# EAGLE design canset pcb (EAGLE 6.4)
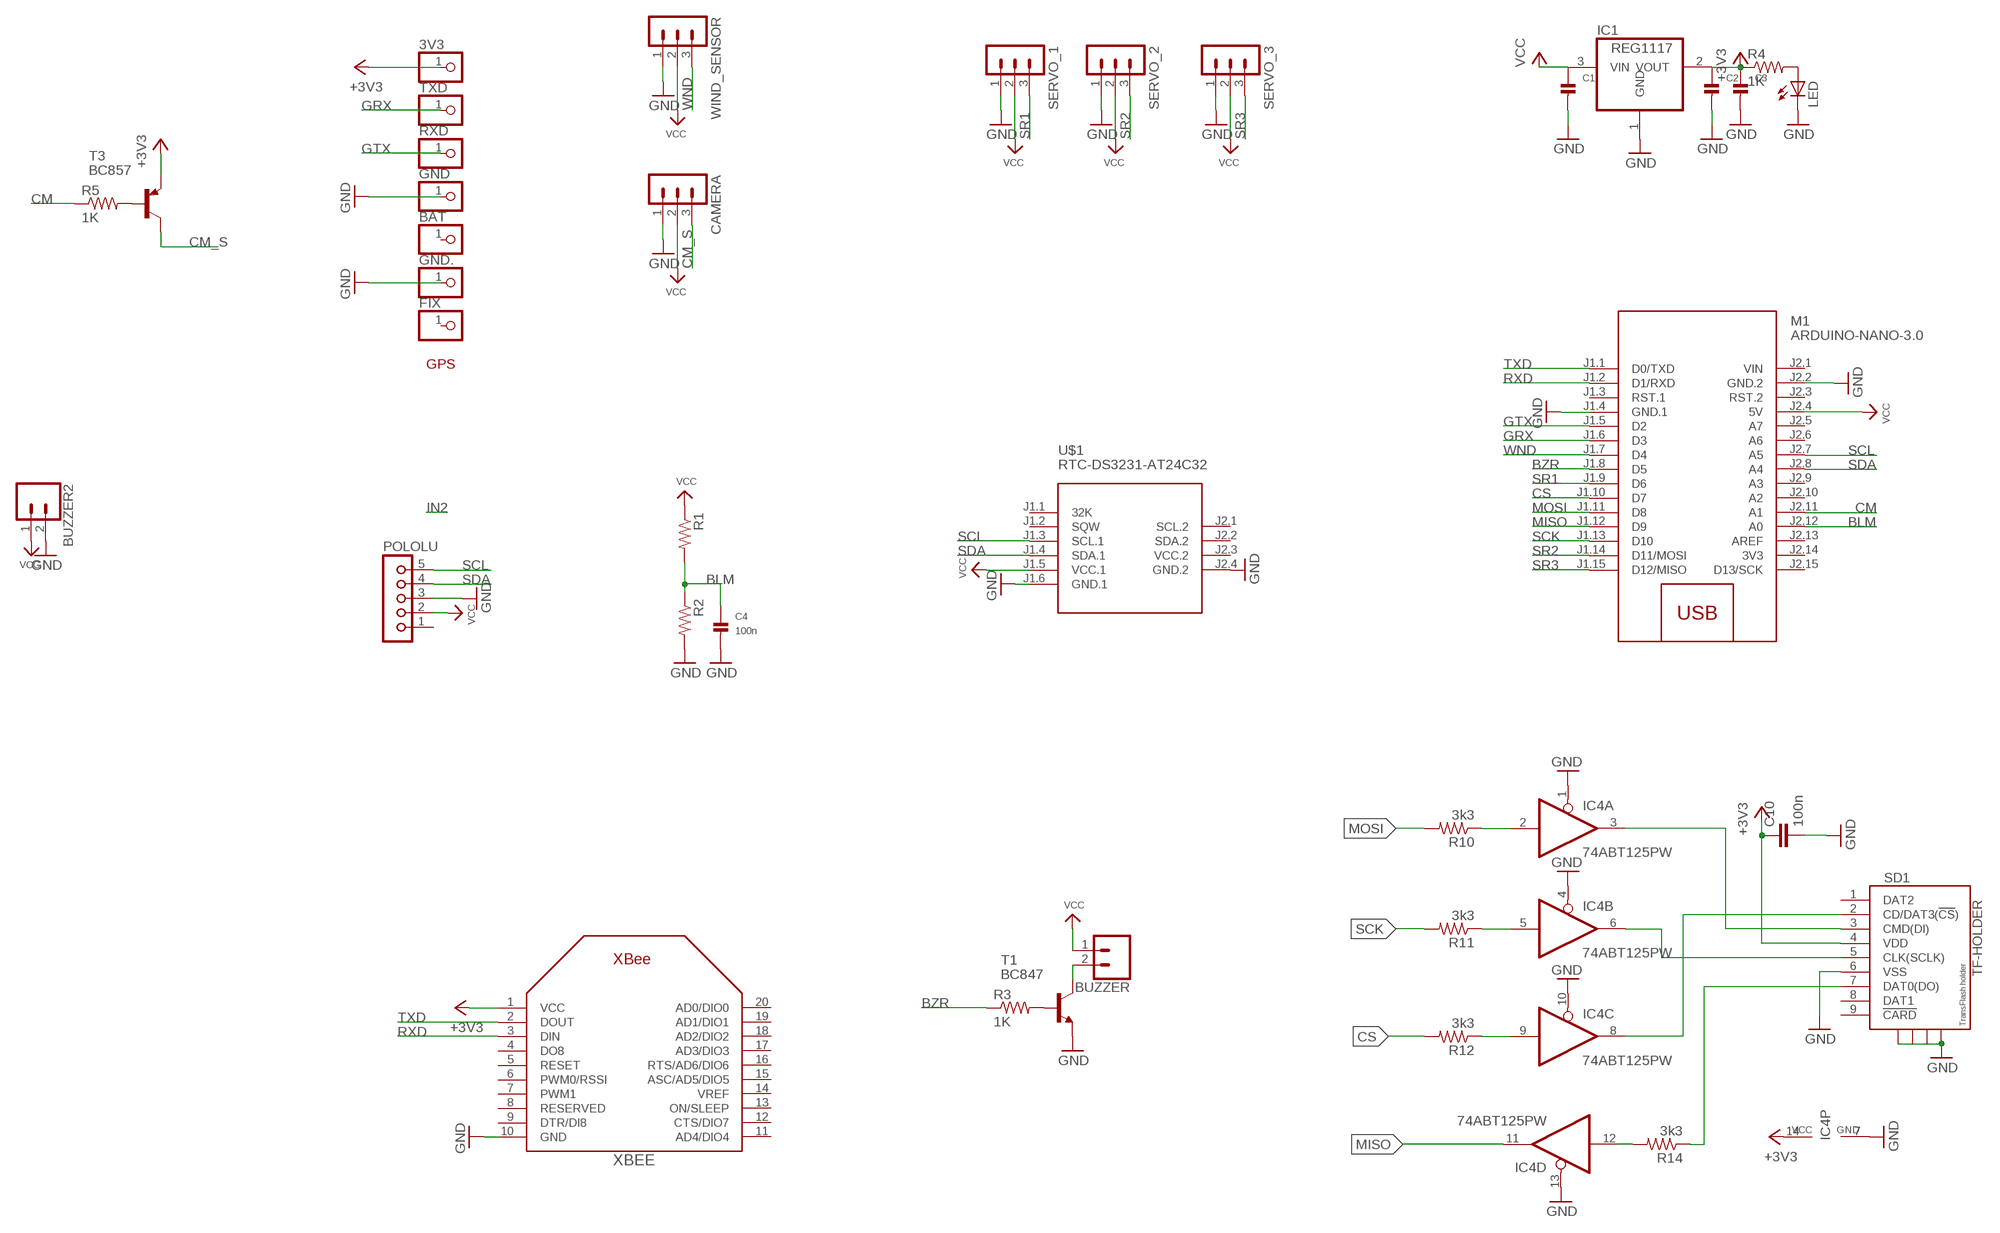
[diagram p0: schematic, sheet 1]

## Parts
3V3  PINHD-1X1  [1X01]
BAT  PINHD-1X1  [1X01]
BUZZER  CONN_02  [1X02]
BUZZER2  CONN_02  [1X02]
C1  CAP_CERAMIC_0805  [_0805]
C2  CAP_CERAMIC_0805  [_0805]
C3  CAP_CERAMIC_0805  [_0805]
C4  100n  CAP_CERAMIC_0805  [_0805]
C10  100n  C-EUC0603  [C0603]
CAMERA  MA03-1  [MA03-1]
FIX  PINHD-1X1  [1X01]
GND  PINHD-1X1  [1X01]
GND.  PINHD-1X1  [1X01]
IC1  REG1117  [SOT223]
IC4  74ABT125PW  [TSSOP14]
LED  LED5MM  [LED5MM]
M1  ARDUINO-NANO-3.0  [ARDUINO-NANO-3.0]
POLOLU  JU05  [JU05]
R1  R-US_M0805  [M0805]
R2  R-US_M0805  [M0805]
R3  1K  R-US_M0805  [M0805]
R4  1K  R-US_M0805  [M0805]
R5  1K  R-US_M0805  [M0805]
R10  3k3  R-US_R0603  [R0603]
R11  3k3  R-US_R0603  [R0603]
R12  3k3  R-US_R0603  [R0603]
R14  3k3  R-US_R0603  [R0603]
RXD  PINHD-1X1  [1X01]
SD1  TF-HOLDER  [TF-PULL]
SERVO_1  MA03-1  [MA03-1]
SERVO_2  MA03-1  [MA03-1]
SERVO_3  MA03-1  [MA03-1]
T1  BC847  [SOT23]
T3  BC857  [SOT23]
TXD  PINHD-1X1  [1X01]
U$1  RTC-DS3231-AT24C32  [RTC-DS3231-AT24C32]
WIND_SENSOR  MA03-1  [MA03-1]
XBEE  XBEE  [XBEE]

## Nets
+3V3: 3V3.1 C2.1 C3.1 C10.1 IC1.2(VOUT) IC4.14(P:VCC) R4.1 SD1.4(VDD) T3.2(E) XBEE.1(VCC)
BLM: C4.1 M1.J2.12(A0) R1.2 R2.1
BZR: M1.J1.8(D5) R3.1
CM: M1.J2.11(A1) R5.1
CM_S: CAMERA.3 T3.3(C)
CS: M1.J1.10(D7) R12.2
GND: BUZZER2.2 C1.2 C2.2 C3.2 C4.2 C10.2 CAMERA.1 GND.1 GND..1 IC1.1(GND) IC4.1(A:OE) IC4.4(B:OE) IC4.7(P:GND) IC4.10(C:OE) IC4.13(D:OE) LED.K(C) M1.J1.4(GND.1) M1.J2.2(GND.2) POLOLU.3 R2.2 SD1.6(VSS) SD1.S1 SD1.S2 SD1.S3 SD1.S4 SERVO_1.1 SERVO_2.1 SERVO_3.1 T1.2(E) U$1.J1.6(GND.1) U$1.J2.4(GND.2) WIND_SENSOR.1 XBEE.10(GND)
GRX: M1.J1.6(D3) TXD.1
GTX: M1.J1.5(D2) RXD.1
MISO: IC4.11(D:O) M1.J1.12(D9)
MOSI: M1.J1.11(D8) R10.2
N$1: R3.2 T1.1(B)
N$2: BUZZER.2 T1.3(C)
N$3: LED.A R4.2
N$4: R5.2 T3.1(B)
N$6: IC4.12(D:I) R14.2
N$7: IC4.2(A:I) R10.1
N$8: IC4.5(B:I) R11.1
N$9: IC4.9(C:I) R12.1
N$11: IC4.3(A:O) SD1.3(CMD(DI))
N$16: R14.1 SD1.7(DAT0(DO))
N$17: IC4.8(C:O) SD1.2(CD/DAT3(!CS!))
N$23: IC4.6(B:O) SD1.5(CLK(SCLK))
RXD: M1.J1.2(D1/RXD) XBEE.3(DIN)
SCK: M1.J1.13(D10) R11.2
SCL: M1.J2.7(A5) POLOLU.5 U$1.J1.3(SCL.1)
SDA: M1.J2.8(A4) POLOLU.4 U$1.J1.4(SDA.1)
SR1: M1.J1.9(D6) SERVO_1.3
SR2: M1.J1.14(D11/MOSI) SERVO_2.3
SR3: M1.J1.15(D12/MISO) SERVO_3.3
TXD: M1.J1.1(D0/TXD) XBEE.2(DOUT)
VCC: BUZZER2.1 BUZZER.1 C1.1 CAMERA.2 IC1.3(VIN) M1.J2.4(5V) POLOLU.2 R1.1 SERVO_1.2 SERVO_2.2 SERVO_3.2 U$1.J1.5(VCC.1) WIND_SENSOR.2
WND: M1.J1.7(D4) WIND_SENSOR.3
Unconnected: BAT.1 FIX.1 M1.J1.3(RST.1) M1.J2.3(RST.2) M1.J2.5(A7) M1.J2.6(A6) M1.J2.9(A3) M1.J2.10(A2) M1.J2.13(AREF) M1.J2.15(D13/SCK) POLOLU.1 SD1.1(DAT2) SD1.8(DAT1) SD1.9(!CARD) U$1.J1.1(32K) U$1.J1.2(SQW) U$1.J2.1(SCL.2) U$1.J2.2(SDA.2) XBEE.4(DO8) XBEE.5(RESET) XBEE.6(PWM0/RSSI) XBEE.7(PWM1) XBEE.8(RESERVED) XBEE.9(DTR/DI8) XBEE.11(AD4/DIO4) XBEE.12(CTS/DIO7) XBEE.13(ON/SLEEP) XBEE.14(VREF) XBEE.15(ASC/AD5/DIO5) XBEE.16(RTS/AD6/DIO6) XBEE.17(AD3/DIO3) XBEE.18(AD2/DIO2) XBEE.19(AD1/DIO1) XBEE.20(AD0/DIO0)

## Notes on the sheet
- GPS

## Power pins joined to a net without a drawn wire
3V3: M1.J2.14(3V3)
VCC.2: U$1.J2.3(VCC.2)
VIN: M1.J2.1(VIN)

## Library data of the parts
3V3 BAT FIX GND GND. RXD TXD = pinhead:PINHD-1X1: PIN HEADER
BUZZER BUZZER2 = design_high:CONN_02: Multi connection point. Often used as Generic Header-pin footprint for 0.1 inch spaced/style header connections On any of the 0.1 inch spaced packages, you can populate with these: Break Away Headers - Straight <https://www.sparkfun.com/products/116> (PRT-00116) Break Away Male Headers - Right Angle <https://www.sparkfun.com/products/553> (PRT-00553) Female Headers <https://www.sparkfun.com/products/115> (PRT-00115) Break Away Headers - Machine Pin <https://www.sparkfun.com/products/117> (PRT-00117) Break Away Female Headers - Swiss Machine Pin <https://www.sparkfun.com/products/743> (PRT-00743) For SCREWTERMINALS and SPRING TERMINALS visit here: Screw Terimnals on SparkFun.com <https://www.sparkfun.com/search/results?term=Screw+Terminals> (5mm/3.5mm/2.54mm spacing) This device is also useful as a general connection point to wire up your design to another part of your project. Our various solder wires solder well into these plated through hole pads. Hook-Up Wire - Assortment (Stranded, 22 AWG) <https://www.sparkfun.com/products/11375> (PRT-11375) Hook-Up Wire - Assortment (Solid Core, 22 AWG) <https://www.sparkfun.com/products/11367> (PRT-11367) View the entire wire category on our website here <https://www.sparkfun.com/categories/141> Special notes: Molex polarized connector foot print use with: PRT-08233 with associated crimp pins and housings. 2.54_SCREWTERM for use with PRT-10571. 3.5mm Screw Terminal footprints for PRT-08084 5mm Screw Terminal footprints for use with PRT-08432
C1-C4 = microbuilder:CAP_CERAMIC: Ceramic Capacitors 0402 - 0402 Surface Mount Capacitors 16pF 50V 5% [Digikey: 445-4899-2-ND] 18pF 50V 5% [Digikey: 490-1281-2-ND] 22pF 50V 5% [Digikey: 490-1283-2-ND] 68pF 50V 5% [Digikey: 490-1289-2-ND] 0.1uF 10V 10% [Digikey: 490-1318-2-ND] 1.0uF 6.3V 10% [Digikey: 490-1320-2-ND] 0603 - 0603 Surface Mount Capacitors 16 pF 50V 5% [Digikey: 445-5051-2-ND] 22 pF 50V [Digikey: PCC220ACVTR-ND] 33 pF 50V 5% [Digikey: 490-1415-1-ND] 56pF 50V 5% [Digikey: 490-1421-1-ND] 220pF 50V 5% [Digikey: 445-1285-1-ND] 680 pF 50V 2200 pF 50V 5% C0G [Digikey: 445-1297-1-ND] 5600 pF 100V 5% X7R [Digikey: 478-3711-1-ND] 0.1 µF 25V 10% [Digikey: PCC2277TR-ND] 0.22 µF 16V 10% X7R [Digikey: 445-1318-1-ND] 1.0 µF 25V 10% [Digikey: 445-5146-2-ND] 0603 - RF Specific 3pF 250V +/-0.1pF RF [Digikey: 712-1347-1-ND] 18 pF 250V 5% [Digikey: 478-3505-1-ND or 712-1322-1-ND] 56 pF 250V 5% C0G RF [Digikey: 490-4867-1-ND] 68 pF 250V RF [Digikey: 490-4868-1-ND] 0805 - 0805 Surface Mount Capacitors 220 pF 250V 2% RF Ceramic Capacitor [Digikey: 712-1398-1-ND] 1000 pF 50V 2% NP0 Ceramic Capacitor [Digikey: 478-3760-1-ND] 0.1 µF 25V 10% Ceramic Capacitor [Digikey: PCC1828TR-ND] 1.0 µF 16V 10% Ceramic Capacitor[Digikey: 490-1691-2-ND] 10.0 µF 10V 10% Ceramic Capacitor[Digikey: 709-1228-1-ND] 10.0 uF 16V 10% Ceramic Capacitor [Digikey: 478-5165-2-ND] 47 uF 6.3V 20% Ceramic Capacitor [Digikey: 587-1779-1-ND or 399-5506-1-ND] 1206 - 1206 Surface Mount Capacitors 47uF 10V 20% Ceramic Capacitor [Digikey: 490-5528-1-ND or 399-5508-1-ND or 445-6010-1-ND] 100uF 6.3V -20%, +80% Y5V Ceramic Capacitor (Digikey: 490-4512-1-ND, Mouser: 81-GRM31CF50J107ZE1L)
C10 = rcl:C-EU: CAPACITOR, European symbol
CAMERA SERVO_1-SERVO_3 WIND_SENSOR = con-lstb:MA03-1: PIN HEADER; OC_FARNELL: unknown; OC_NEWARK: unknown
IC1 = burr-brown:REG1117: 800mA and 1A Low Dropout (LDO) Positive Regulator 1.8V, 2.5V, 2.85V, 3.3V, 5V, and Adj; MPN: REG1117; OC_FARNELL: 1097566; OC_NEWARK: 14P6981
IC4 = 74xx-eu:74*125: Quad bus BUFFER, 3-state
LED = adafruit:LED: LED OSRAM: - CHIPLED LG R971, LG N971, LY N971, LG Q971, LY Q971, LO R971, LY R971 LH N974, LH R974 LS Q976, LO Q976, LY Q976 LO Q996 - Hyper CHIPLED LW Q18S LB Q993, LB Q99A, LB R99A - SideLED LS A670, LO A670, LY A670, LG A670, LP A670 LB A673, LV A673, LT A673, LW A673 LH A674 LY A675 LS A676, LA A676, LO A676, LY A676, LW A676 LS A679, LY A679, LG A679 - Hyper Micro SIDELED® LS Y876, LA Y876, LO Y876, LY Y876 LT Y87S - SmartLED LW L88C, LW L88S LB L89C, LB L89S, LG L890 LS L89K, LO L89K, LY L89K LS L896, LA L896, LO L896, LY L896 - TOPLED LS T670, LO T670, LY T670, LG T670, LP T670 LSG T670, LSP T670, LSY T670, LOP T670, LYG T670 LG T671, LOG T671, LSG T671 LB T673, LV T673, LT T673, LW T673 LH T674 LS T676, LA T676, LO T676, LY T676, LB T676, LH T676, LSB T676, LW T676 LB T67C, LV T67C, LT T67C, LS T67K, LO T67K, LY T67K, LW E67C LS E67B, LA E67B, LO E67B, LY E67B, LB E67C, LV E67C, LT E67C LW T67C LS T679, LY T679, LG T679 LS T770, LO T770, LY T770, LG T770, LP T770 LB T773, LV T773, LT T773, LW T773 LH T774 LS E675, LA E675, LY E675, LS T675 LS T776, LA T776, LO T776, LY T776, LB T776 LHGB T686 LT T68C, LB T68C - Hyper Mini TOPLED® LB M676 - Mini TOPLED Santana® LG M470 LS M47K, LO M47K, LY M47K Source: http://www.osram.convergy.de/
M1 = diy-modules:ARDUINO-NANO-3.0: Arduino Nano 3.0
POLOLU = con-lsta:JU05: PIN HEADER; OC_FARNELL: unknown; OC_NEWARK: unknown
R1-R5 R10-R12 R14 = adafruit:R-US_: RESISTOR, American symbol
SD1 = sd-mmc:TF-HOLDER: TF / Micro SD socket is PUSH-PUSH type, the card can be pushed into and auto locked and pushed out by simply press the card. Surface Mounting type.
T1 = nxp_60:BC847: 45 V, 100 mA NPN general-purpose transistors NPN general-purpose transistor AAL Eindhoven MK
T3 = nxp_60:BC857: PNP general purpose transistors AAL Eindhoven MK
U$1 = diy-modules (2):RTC-DS3231-AT24C32: RTC Module with Battery and EEPROM based on DS3231 and AT24C32 chips Tutorial can be found here: https://edwardmallon.wordpress.com/2014/05/21/using-a-cheap-3-ds3231-rtc-at24c32-eeprom-from-ebay/ Click here to find device on ebay.com <http://www.ebay.com/sch/DS3231+AT24C32+module>
XBEE = adafruit:XBEE

## Net classes
0 default: width 0.152 mm, drill 0.305 mm, clearance 0.152 mm

## Board
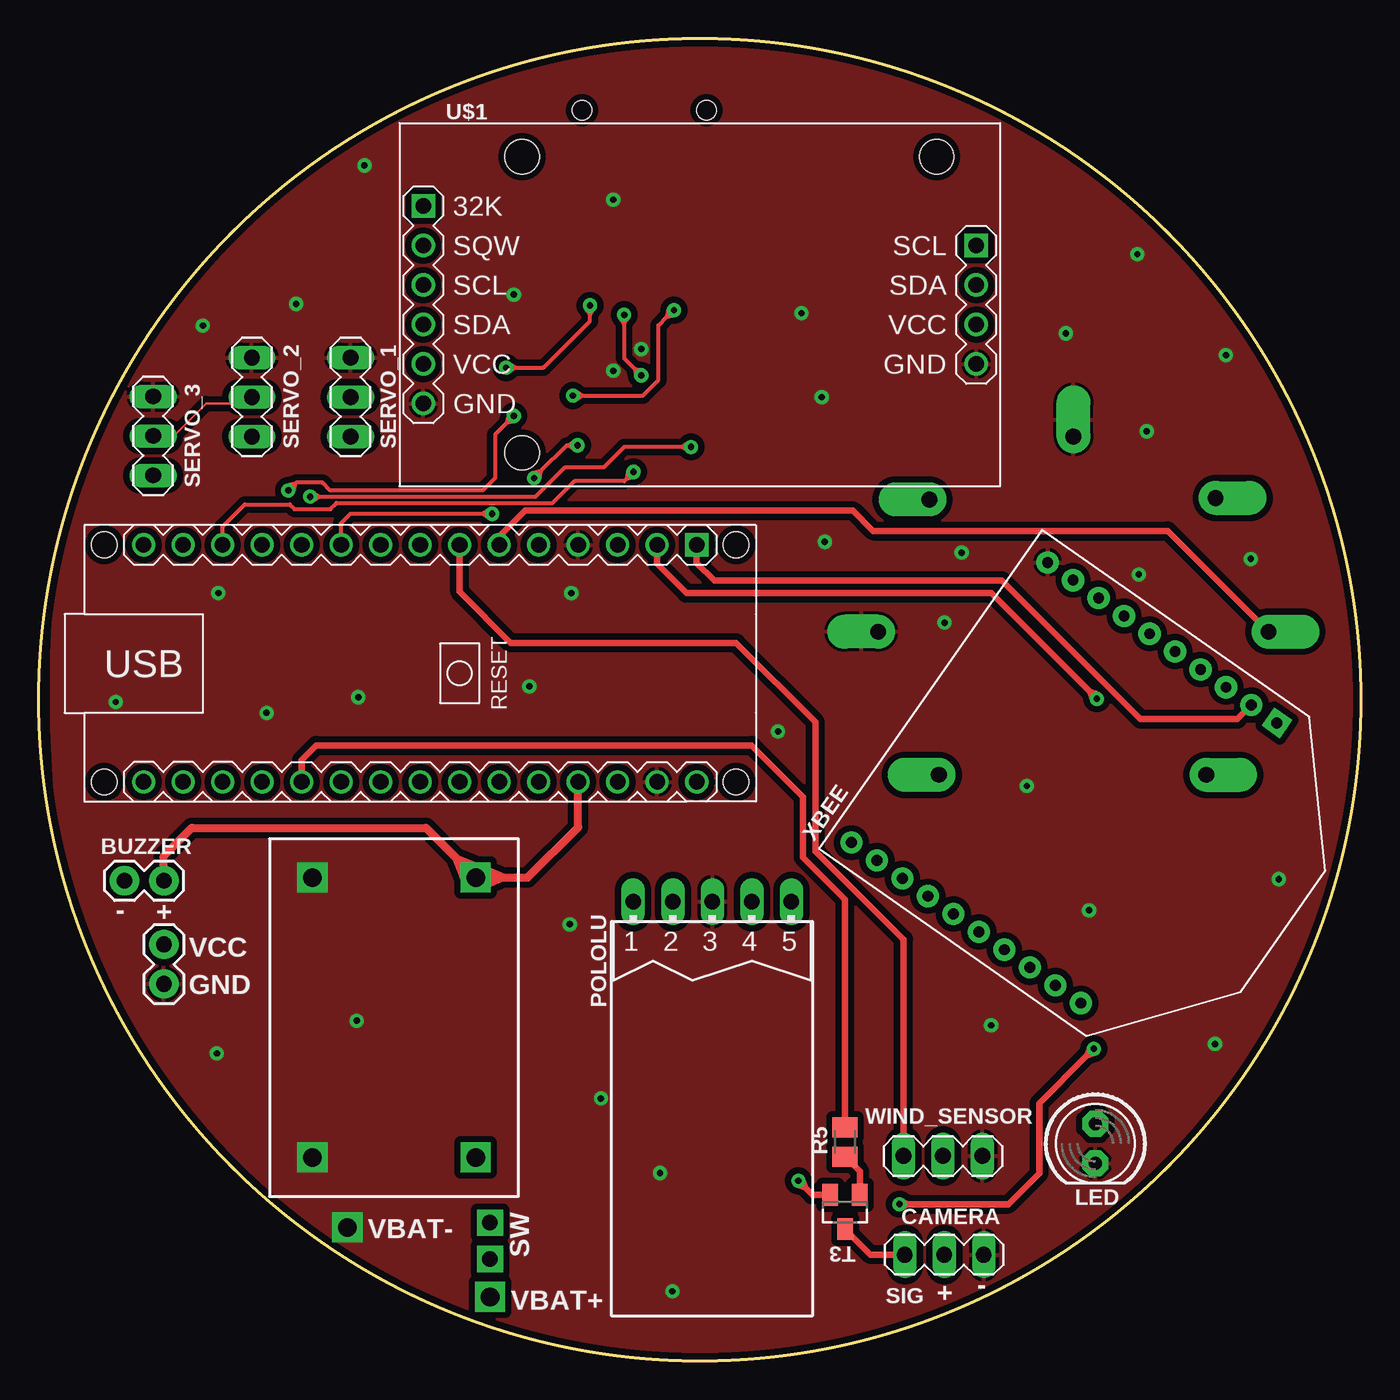
[diagram p1: board, top side]
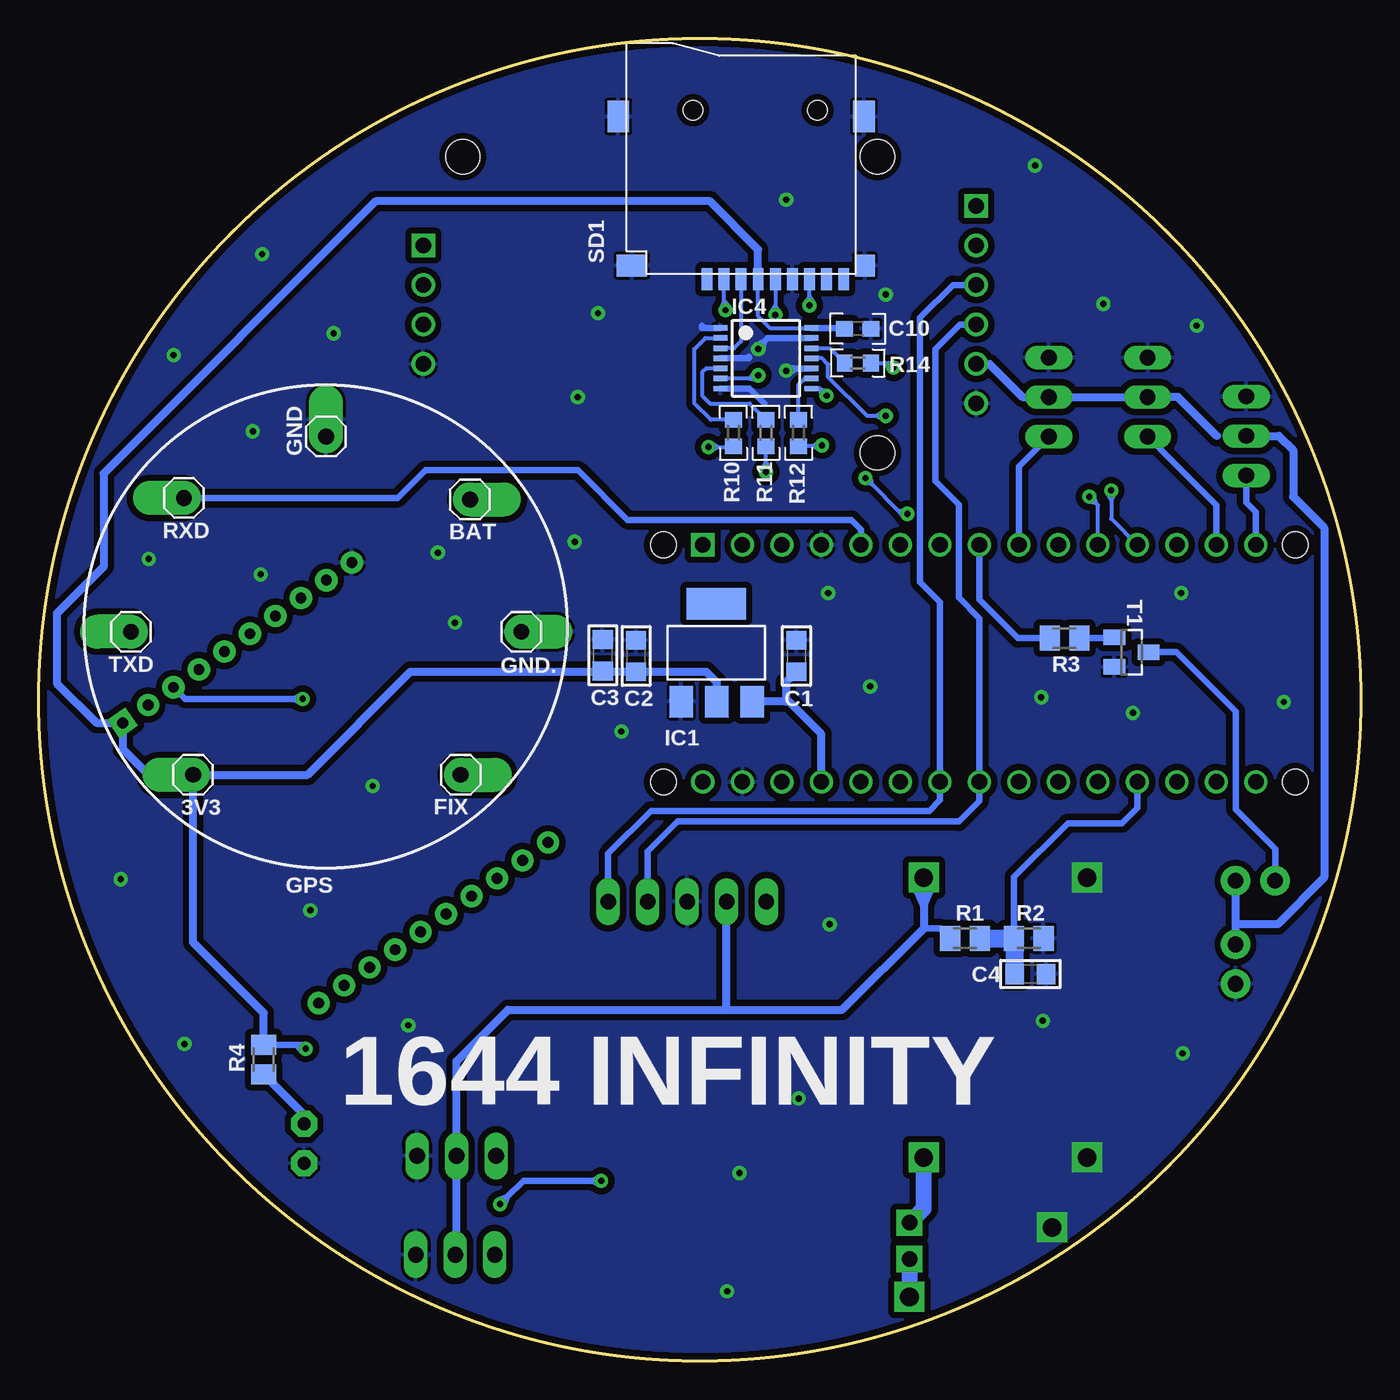
[diagram p2: board, bottom side, seen from below]

Size 85 x 85 mm. Coordinates in mm from the lower left corner, seen from the top.
Outline: circle at 42.5,42.5 radius 42.5
Copper layers (1*16): Top 0.035mm / dielectric 1mm / Bottom 0.035mm
Design rules "TechGalaxy": minimum track width 0.1mm, minimum drill 0.15mm, track to track 0.125mm, track to pad 0.125mm, pad to pad 0.125mm, via to via 0.125mm, smd to smd 0.125mm, copper to edge 0.25mm, drill to drill 0.15mm, minimum pad ring 0.105mm, minimum via ring 0.25mm, stop-mask expansion 2mil, vias tented up to drill 30mil, thermal gap 0.2mm

### Footprints (pad centres in the part's own frame; a part is rotated, then mirrored left to right if it is on the bottom)
1X01 = drill 1.016 pad 2.184 offset: 1 0,0
1X02 = drill 1.016 pad 1.88: 1 0,0; 2 2.54,0
_0805 = smd 1.2 x 1.3: 1 -1.016,0; 2 1.016,0
C0603 = smd 1.1 x 1: 1 -0.85,0; 2 0.85,0
MA03-1 = drill 1.016 long: 1 -2.54,0; 2 0,0; 3 2.54,0
SOT223 = smd 1.499 x 2.007: 1 -2.261,-3.15; 2 0.025,-3.15; 3 2.311,-3.15 | smd 3.81 x 2.007: 4 0,3.15
TSSOP14 = smd 0.35 x 0.9: 1 -1.95,-2.925; 2 -1.3,-2.925; 3 -0.65,-2.925; 4 0,-2.925; 5 0.65,-2.925; 6 1.3,-2.925; 7 1.95,-2.925; 8 1.95,2.925; 9 1.3,2.925; 10 0.65,2.925; 11 0,2.925; 12 -0.65,2.925; 13 -1.3,2.925; 14 -1.95,2.925
LED5MM = drill 0.813 pad 1.676 octagon: A -1.27,0; K 1.27,0
ARDUINO-NANO-3.0 = drill 1 square: J1.1 17.78,7.62 | drill 1: J1.2 15.24,7.62; J1.3 12.7,7.62; J1.4 10.16,7.62; J1.5 7.62,7.62; J1.6 5.08,7.62; J1.7 2.54,7.62; J1.8 0,7.62; J1.9 -2.54,7.62; J1.10 -5.08,7.62; J1.11 -7.62,7.62; J1.12 -10.16,7.62; J1.13 -12.7,7.62; J1.14 -15.24,7.62; J1.15 -17.78,7.62; J2.1 17.78,-7.62; J2.2 15.24,-7.62; J2.3 12.7,-7.62; J2.4 10.16,-7.62; J2.5 7.62,-7.62; J2.6 5.08,-7.62; J2.7 2.54,-7.62; J2.8 0,-7.62; J2.9 -2.54,-7.62; J2.10 -5.08,-7.62; J2.11 -7.62,-7.62; J2.12 -10.16,-7.62; J2.13 -12.7,-7.62; J2.14 -15.24,-7.62; J2.15 -17.78,-7.62 | hole 1.651: -20.32,7.62; -20.32,-7.62; 20.32,-7.62; 20.32,7.62
JU05 = drill 1.016 long: 1 -5.08,0; 2 -2.54,0; 3 0,0; 4 2.54,0; 5 5.08,0
M0805 = smd 1.3 x 1.6: 1 -0.95,0; 2 0.95,0
R0603 = smd 1 x 1.1: 1 -0.85,0; 2 0.85,0
TF-PULL = smd 0.7 x 1.4: 1 -2.2,-7.62; 2 -1.1,-7.62; 3 0,-7.62; 4 1.1,-7.62; 5 2.2,-7.62; 6 3.3,-7.62; 7 4.4,-7.62; 8 5.5,-7.62; 9 6.6,-7.62 | smd 1.4 x 2: S1 -7.9,2.85; S2 7.9,2.85 | smd 1.28 x 1.4: S3 7.96,-6.75 | smd 1.95 x 1.4: S4 -7.025,-6.75 | hole 1.25: -3.1,3.25; 4.9,3.25
SOT23 = smd 1 x 1.4: 1 -0.95,-1.1; 2 0.95,-1.1; 3 0,1.1
RTC-DS3231-AT24C32 = drill 1 square: J1.1 -17.78,6.35; J2.1 17.78,3.81 | drill 1: J1.2 -17.78,3.81; J1.3 -17.78,1.27; J1.4 -17.78,-1.27; J1.5 -17.78,-3.81; J1.6 -17.78,-6.35; J2.2 17.78,1.27; J2.3 17.78,-1.27; J2.4 17.78,-3.81 | hole 2.2: -11.43,-9.525; -11.43,9.525; 15.24,9.525
XBEE = drill 0.7 pad 1.422 square: 1 -11,5.5 | drill 0.7 pad 1.422: 2 -11,3.5; 3 -11,1.5; 4 -11,-0.5; 5 -11,-2.5; 6 -11,-4.5; 7 -11,-6.5; 8 -11,-8.5; 9 -11,-10.5; 10 -11,-12.5; 11 11,-12.5; 12 11,-10.5; 13 11,-8.5; 14 11,-6.5; 15 11,-4.5; 16 11,-2.5; 17 11,-0.5; 18 11,1.5; 19 11,3.5; 20 11,5.5

### Placement (x,y rotation side)
3V3  75.08,37.68 180 bottom
BAT  57.28,55.38 0 bottom
BUZZER  8.04,30.86 180 top
BUZZER2  8.04,26.76 270 top
C1  36.28,45.32 90 bottom
C2  46.59,45.32 90 bottom
C3  48.74,45.36 90 bottom
C4  21.24,24.86 0 bottom
C10  32.34,66.36 0 bottom
CAMERA  58.22,6.81 180 top
FIX  57.88,37.68 0 bottom
GND  66.53,59.43 90 bottom
GND.  53.98,46.88 0 bottom
IC1  41.43,45.52 0 bottom
IC4  38.24,64.46 270 bottom
LED  67.94,13.96 270 top
M1  24.52,44.84 0 top
POLOLU  43.3,29.52 0 top
R1  25.44,27.16 0 bottom
R2  21.34,27.16 0 bottom
R3  19.04,46.46 0 bottom
R4  70.54,19.36 270 bottom
R5  51.84,14.06 270 top
R10  40.34,59.66 270 bottom
R11  38.24,59.66 270 bottom
R12  36.14,59.66 270 bottom
R14  32.34,64.16 180 bottom
RXD  75.68,55.48 180 bottom
SD1  39.84,77.16 0 bottom
SERVO_1  20.05,61.97 270 top
SERVO_2  13.7,61.97 270 top
SERVO_3  7.35,59.47 270 top
T1  14.74,45.56 270 bottom
T3  51.84,9.56 180 top
TXD  79.08,46.88 180 bottom
U$1  42.5,67.9 0 top
WIND_SENSOR  58.14,13.16 180 top
XBEE  68.81,35.15 235 top

### Tracks (layer width: path | path; a pad name or v marks a point on that pad's centre or on a via)
+3V3  (via drill 0.41)
  Top 0.406: T3.2 49.74,10.66 49.27,11.13 | 49.27,11.13 v48.84,11.56 | v55.34,10.06 55.95,10.06 | 55.95,10.06 62.34,10.06 64.34,12.06 64.34,16.56 67.41,19.63 | 67.41,19.63 v67.84,20.06 | 49.27,11.13 49.07,11.65 v48.84,11.56 | 49.27,11.13 48.75,11.33 v48.84,11.56 | 55.95,10.06 55.44,10.29 v55.34,10.06 | 55.95,10.06 55.44,9.83 v55.34,10.06 | 67.41,19.63 67.93,19.83 v67.84,20.06 | 67.41,19.63 67.61,20.15 v67.84,20.06
  Bottom 0.254: IC4.14 37.99,66.41 38.74,67.16 SD1.4
  Bottom 0.406: IC4.14 33.24,66.41 C10.1 | v48.84,11.56 49.45,11.56 | 49.45,11.56 53.84,11.56 54.91,10.49 | 54.91,10.49 v55.34,10.06 | v67.84,20.06 68.09,20.31 | 68.09,20.31 68.4,20.31 | 68.4,20.31 R4.1 | 49.45,11.56 48.94,11.79 v48.84,11.56 | 49.45,11.56 48.94,11.33 v48.84,11.56 | 54.91,10.49 55.11,9.97 v55.34,10.06 | 54.91,10.49 55.43,10.29 v55.34,10.06 | 68.09,20.31 67.84,20.31 v67.84,20.06 | 68.4,20.31 68.03,19.89 v67.84,20.06
  Bottom 0.508: 3V3.1 75.19,37.56 77.84,37.56 79.62,39.34 XBEE.1 81.29,41.01 83.84,43.56 83.84,48.06 80.84,51.06 80.84,57.06 63.34,74.56 41.84,74.56 38.74,71.46 SD1.4 | 3V3.1 67.72,37.68 61.1,44.3 48.7,44.3 | 48.7,44.3 C2.1 42.08,44.3 41.41,43.63 IC1.2 | C3.1 48.7,44.3 | R4.1 70.54,22.36 75.08,26.9 3V3.1
BLM
  Bottom 0.406: M1.J2.12 14.36,35.54 15.34,34.56 18.84,34.56 22.29,31.11 R2.1
  Bottom 1.143: R1.2 R2.1 22.26,27.13 C4.1
BZR
  Bottom 0.406: R3.1 22.04,46.46 24.52,48.94 M1.J1.8
CM
  Top 0.406: M1.J2.11 16.9,38.62 17.84,39.56 45.84,39.56 49.14,36.26 49.14,32.36 51.84,29.66 R5.1
CM_S
  Top 0.406: CAMERA.3 53.49,6.81 T3.3
CS  (via drill 0.41)
  Top 0.254: M1.J1.10 19.44,53.86 20.04,54.46 28.53,54.46 | 28.53,54.46 v29.14,54.46 | v31.84,56.76 32.27,57.19 | 32.27,57.19 33.94,58.86 34.03,58.86 | 34.03,58.86 v34.64,58.86 | 28.53,54.46 28.97,54.18 v29.14,54.46 | 28.53,54.46 28.97,54.74 v29.14,54.46 | 32.27,57.19 31.77,57.08 v31.84,56.76 | 32.27,57.19 32.16,56.69 v31.84,56.76 | 34.03,58.86 34.47,58.58 v34.64,58.86 | 34.03,58.86 34.47,59.14 v34.64,58.86
  Bottom 0.254: v29.14,54.46 29.54,54.46 29.72,54.64 | 29.72,54.64 31.41,56.33 | 31.41,56.33 v31.84,56.76 | v34.64,58.86 34.69,58.81 35.25,58.81 | 35.25,58.81 R12.2 | 29.72,54.64 29.22,54.78 v29.14,54.46 | 29.72,54.64 29.39,54.25 v29.14,54.46 | 31.41,56.33 31.91,56.44 v31.84,56.76 | 31.41,56.33 31.52,56.83 v31.84,56.76 | 35.25,58.81 34.84,59.12 v34.64,58.86 | 35.25,58.81 34.79,58.57 v34.64,58.86
GND  (via drill 0.41, 1.2 pad 1.93)
  Bottom 0.406: IC4.1 42.34,66.41 42.34,66.56 | IC4.4 39.34,64.46 39.34,64.56 | IC4.13 38.14,65.76 38.36,65.54 | 38.36,65.54 38.84,65.06 | IC4.7 39.29,62.51 38.34,61.56 | IC4.10 36.35,63.81 | 36.35,63.81 36.59,63.81 36.84,63.56 | 38.36,65.54 38.5,65 v38.74,65.06 38.86,65.28 38.36,65.54 | 36.35,63.81 36.79,63.46 v36.94,63.66 36.9,63.91 36.35,63.81
  other vias: 19.84,8.56 17.59,13.06 17.59,31.06 71.24,59.76 77.94,51.56 63.54,36.96 58.24,47.46 50.54,52.66 59.34,51.96 70.74,50.56 79.74,30.96 67.54,28.96 20.44,21.86 11.44,19.76 34.14,28.06 39.94,12.06 61.24,21.56 75.64,20.36 20.54,42.66 31.54,43.36 47.54,40.46 34.24,49.36 14.64,41.66 11.54,49.36 10.54,66.56 16.54,67.96 36.94,74.66 49.04,67.36 50.34,61.96 66.04,66.06 70.64,71.16 4.94,42.36 36.14,16.86 40.74,4.46 76.34,64.66 20.94,76.86 30.54,68.56
  pour Top (isolate 0.406): 0.84,40.65 0.84,45.46 arc-89 40.94,86.04 arc-91 84.84,42.66 84.84,41.3 arc-89 44.1,0.07 41.93,0.05 arc-91
  pour Bottom (isolate 0.406): 0.84,40.65 0.84,45.46 arc-89 40.94,86.04 arc-91 84.84,42.66 84.84,41.3 arc-89 44.1,0.07 41.93,0.05 arc-91
GRX
  Top 0.406: M1.J1.6 29.6,53 31.26,54.66 52.34,54.66 53.64,53.36 72.59,53.36 TXD.1
GTX
  Bottom 0.406: M1.J1.5 32.14,53.46 32.74,54.06 47.14,54.06 50.34,57.26 60.14,57.26 61.92,55.48 RXD.1
IN1  (via drill 1 pad 1.68, 1.2 pad 1.93)
  Bottom 1.016: v29.01,6.53 v29.01,4.09
IN2  (via drill 1 pad 1.68, 1.2 pad 1.93)
  Bottom 1.016: v29.01,8.87 28.09,9.79 v28.09,13.06
  Bottom 1.143: v29.01,8.87 29.1,8.96
MISO  (via drill 0.41)
  Top 0.254: v30.54,60.76 30.11,60.33 | 30.11,60.33 29.34,59.56 29.34,56.76 28.54,55.96 18.74,55.96 18.24,56.46 16.54,56.46 16.47,56.39 | 16.47,56.39 v16.04,55.96 | 30.11,60.33 30.61,60.44 v30.54,60.76 | 30.11,60.33 30.22,60.83 v30.54,60.76 | 16.47,56.39 15.97,56.28 v16.04,55.96 | 16.47,56.39 16.36,55.89 v16.04,55.96
  Bottom 0.254: IC4.11 34.64,64.46 34.24,64.06 34.24,63.26 31.74,60.76 31.15,60.76 | 31.15,60.76 v30.54,60.76 | v16.04,55.96 16.04,55.35 | 16.04,55.35 16.04,54.14 M1.J1.12 | 31.15,60.76 30.72,61.04 v30.54,60.76 | 31.15,60.76 30.72,60.48 v30.54,60.76 | 16.04,55.35 16.32,55.78 v16.04,55.96 | 16.04,55.35 15.76,55.78 v16.04,55.96
MOSI  (via drill 0.41)
  Top 0.254: v17.44,55.56 18.05,55.56 | 18.05,55.56 31.94,55.56 33.84,57.46 36.34,57.46 37.64,58.76 41.33,58.76 | v41.94,58.76 41.33,58.76 | 18.05,55.56 17.62,55.84 v17.44,55.56 | 18.05,55.56 17.62,55.28 v17.44,55.56 | 41.33,58.76 41.77,58.48 v41.94,58.76 | 41.33,58.76 41.77,59.04 v41.94,58.76
  Bottom 0.254: M1.J1.11 16.9,55.02 17.01,55.13 | 17.01,55.13 v17.44,55.56 | v41.94,58.76 41.33,58.76 | 41.33,58.76 40.39,58.76 R10.2 | 17.01,55.13 17.51,55.24 v17.44,55.56 | 17.01,55.13 17.12,55.63 v17.44,55.56 | 41.33,58.76 41.77,58.48 v41.94,58.76 | 41.33,58.76 41.77,59.04 v41.94,58.76
N$1
  Bottom 0.406: T1.1 15.89,46.46 R3.2
N$2
  Bottom 0.406: BUZZER.2 5.5,32.92 8.04,35.46 8.04,41.76 11.84,45.56 T1.3
N$3
  Bottom 0.508: LED.A 67.94,15.81 R4.2
N$4
  Top 0.406: T3.1 52.79,12.16 R5.2
N$6
  Bottom 0.254: IC4.12 34.14,65.11 R14.2
N$7
  Bottom 0.254: R10.1 41.79,60.51 42.84,61.56 42.84,65.06 42.14,65.76 IC4.2
N$8
  Bottom 0.254: IC4.5 42.09,63.81 42.34,63.56 42.34,62.06 41.84,61.56 39.29,61.56 R11.1
N$9
  Bottom 0.254: R12.1 36.14,62.76 35.74,63.16 IC4.9
N$11
  Bottom 0.254: SD1.3 39.84,65.56 40.29,65.11 IC4.3
N$16  (via drill 0.41)
  Top 0.254: v30.04,63.86 30.65,63.86 | 30.65,63.86 32.44,63.86 35.44,66.86 35.44,67.25 | 35.44,67.25 v35.44,67.86 | 30.65,63.86 30.22,64.14 v30.04,63.86 | 30.65,63.86 30.22,63.58 v30.04,63.86 | 35.44,67.25 35.72,67.69 v35.44,67.86 | 35.44,67.25 35.16,67.69 v35.44,67.86
  Bottom 0.254: R14.1 30.57,64.16 | 30.57,64.16 30.34,64.16 v30.04,63.86 | v35.44,67.86 35.44,68.47 | 35.44,68.47 SD1.7 | 30.57,64.16 30.06,64.19 v30.04,63.86 | 30.57,64.16 30.33,63.71 v30.04,63.86 | 35.44,68.47 35.16,68.03 v35.44,67.86 | 35.44,68.47 35.72,68.03 v35.44,67.86
N$17  (via drill 0.41)
  Top 0.254: v34.34,62.06 34.95,62.06 | 34.95,62.06 38.84,62.06 39.84,63.06 39.84,66.56 40.41,67.13 | 40.41,67.13 v40.84,67.56 | 34.95,62.06 34.52,62.34 v34.34,62.06 | 34.95,62.06 34.52,61.78 v34.34,62.06 | 40.41,67.13 40.91,67.24 v40.84,67.56 | 40.41,67.13 40.52,67.63 v40.84,67.56
  Bottom 0.254: IC4.8 34.79,62.51 34.77,62.49 | 34.77,62.49 v34.34,62.06 | v40.84,67.56 40.94,67.66 40.94,68.16 | 40.94,68.16 SD1.2 | 34.77,62.49 34.27,62.38 v34.34,62.06 | 34.77,62.49 34.66,61.99 v34.34,62.06 | 40.94,68.16 40.6,67.78 v40.84,67.56 | 40.94,68.16 41.14,67.69 v40.84,67.56
N$23  (via drill 0.41)
  Top 0.254: v37.64,67.26 37.64,66.65 | 37.64,66.65 37.64,64.46 38.31,63.79 | 38.31,63.79 v38.74,63.36 | 37.64,66.65 37.92,67.08 v37.64,67.26 | 37.64,66.65 37.36,67.08 v37.64,67.26 | 38.31,63.79 38.42,63.29 v38.74,63.36 | 38.31,63.79 38.81,63.68 v38.74,63.36
  Bottom 0.254: SD1.5 37.64,67.87 | 37.64,67.87 v37.64,67.26 | v38.74,63.36 38.94,63.16 39.32,63.16 | 39.32,63.16 IC4.6 | 37.64,67.87 37.36,67.44 v37.64,67.26 | 37.64,67.87 37.92,67.44 v37.64,67.26 | 39.32,63.16 39,63.56 v38.74,63.36 | 39.32,63.16 38.81,63.04 v38.74,63.36
RXD  (via drill 0.41)
  Top 0.406: M1.J1.2 39.76,51.24 41.64,49.36 61.24,49.36 67.61,42.99 | 67.61,42.99 v68.04,42.56 | 67.61,42.99 67.81,42.47 v68.04,42.56 | 67.61,42.99 68.13,42.79 v68.04,42.56
  Bottom 0.406: v68.04,42.56 68.65,42.56 | 68.65,42.56 75.6,42.56 XBEE.3 | 68.65,42.56 68.14,42.79 v68.04,42.56 | 68.65,42.56 68.14,42.33 v68.04,42.56
SCK  (via drill 0.41)
  Top 0.254: v38.24,57.16 37.81,56.73 | 37.81,56.73 37.64,56.56 34.44,56.56 33.04,55.16 19.14,55.16 18.74,54.76 16.44,54.76 16.14,55.06 13.25,55.06 11.82,53.63 M1.J1.13 | 37.81,56.73 38.31,56.84 v38.24,57.16 | 37.81,56.73 37.92,57.23 v38.24,57.16
  Bottom 0.254: v38.24,57.16 38.24,57.77 | 38.24,57.77 R11.2 | 38.24,57.77 37.96,57.33 v38.24,57.16 | 38.24,57.77 38.52,57.33 v38.24,57.16
SCL
  Bottom 0.406: POLOLU.5 48.39,32.61 45.64,35.36 27.74,35.36 27.06,36.04 M1.J2.7 27.06,48.78 28.34,50.06 28.34,67.06 26.23,69.17 U$1.J1.3
SDA
  Bottom 0.406: POLOLU.4 45.85,32.75 43.94,34.66 25.84,34.66 24.52,35.98 M1.J2.8 24.52,47.74 25.84,49.06 25.84,55.06 27.34,56.56 27.34,65.06 25.77,66.63 U$1.J1.4
SR1
  Bottom 0.406: M1.J1.9 21.98,57.5 SERVO_1.3
SR2
  Bottom 0.406: M1.J1.14 9.28,55.01 SERVO_2.3
SR3
  Bottom 0.406: M1.J1.15 6.74,54.56 7.35,55.17 SERVO_3.3
TXD
  Top 0.406: M1.J1.1 42.3,51.3 43.44,50.16 61.94,50.16 70.84,41.26 77.09,41.26 XBEE.2
VCC  (via drill 1.2 pad 1.93)
  Top 0.152: SERVO_2.2 13.29,61.55 10.75,61.55 8.21,59.01 SERVO_3.2
  Top 0.508: M1.J2.4 34.68,34.3 31.44,31.06 29.89,31.06 | v28.09,31.06 29.89,31.06 | BUZZER.1 8.04,32.46 9.84,34.26 24.89,34.26 26.82,32.33 | 26.82,32.33 v28.09,31.06 | 29.89,31.06 28.37,31.71 v28.09,31.06 | 29.89,31.06 28.37,30.41 v28.09,31.06 | 26.82,32.33 27.43,30.8 v28.09,31.06 | 26.82,32.33 28.35,31.72 v28.09,31.06
  Bottom 0.406: R1.1 27.04,27.81 28.09,27.81
  Bottom 0.508: M1.J2.4 34.68,40.3 36.75,42.37 36.94,42.37 | 36.94,42.37 IC1.3 | C1.1 36.94,43.64 36.94,42.37 | CAMERA.2 58.14,6.9 WIND_SENSOR.2 58.14,19.26 54.84,22.56 40.77,22.56 | 40.77,22.56 POLOLU.2 | v28.09,31.06 28.09,29.26 | 28.09,29.26 28.09,27.81 33.34,22.56 40.77,22.56 | BUZZER2.1 8.04,28.06 | 8.04,28.06 BUZZER.1 | U$1.J1.5 23.87,64.09 21.75,61.97 SERVO_1.2 SERVO_2.2 11.75,61.97 9.25,59.47 | SERVO_3.2 5.25,59.47 4.34,58.56 4.34,55.56 2.34,53.56 2.34,31.06 5.34,28.06 8.04,28.06 | 28.09,29.26 28.74,30.78 v28.09,31.06 | 28.09,29.26 27.44,30.78 v28.09,31.06
WND
  Top 0.406: WIND_SENSOR.3 55.6,27.1 49.94,32.76 49.94,41.06 44.84,46.16 30.34,46.16 27.06,49.44 M1.J1.7

### Text on the board
tPlace: - | + | VCC | GND | VBAT- | SW | - | VBAT+ | SIG | +
bPlace: GPS | 1644 INFINITY